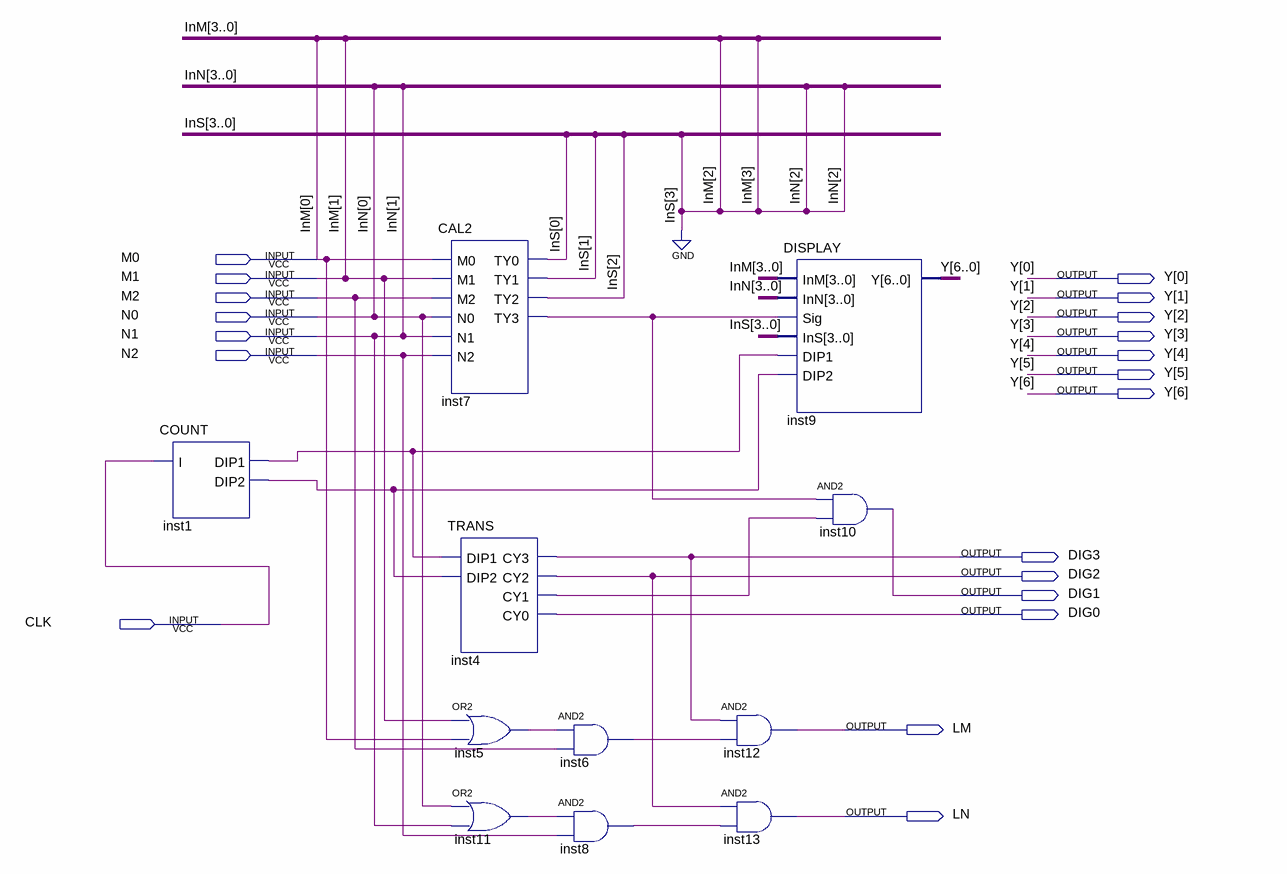
[diagram p0: schematic sheet]
// Quartus schematic FINAL.bdf as structural Verilog: 11 symbols, 20 pins
module FINAL (
  input  M0,
  input  M1,
  input  M2,
  input  N0,
  input  N1,
  input  N2,
  input  CLK,
  output [6:0] Y,
  output DIG3,
  output DIG2,
  output DIG1,
  output DIG0,
  output LM,
  output LN
);

  wire inst1_dip1, inst1_dip2, inst4_cy1, inst5_out, inst6_out, inst7_ty3, inst8_out, inst11_out;
  wire [2:0] InS;
  wire [3:3] InN;

  COUNT inst1 (.I(CLK), .DIP1(inst1_dip1), .DIP2(inst1_dip2));
  CAL2 inst7 (
    .M0(M0), .M1(M1), .M2(M2), .N0(N0), .N1(N1), .N2(N2), .TY0(InS[0]), .TY1(InS[1]), .TY2(InS[2]),
    .TY3(inst7_ty3));
  TRANS inst4 (.DIP1(inst1_dip1), .DIP2(inst1_dip2), .CY3(DIG3), .CY2(DIG2), .CY1(inst4_cy1), .CY0(DIG0));
  or inst5 (inst5_out, M1, M0);
  or inst11 (inst11_out, N0, N1);
  and inst6 (inst6_out, inst5_out, M2);
  and inst8 (inst8_out, inst11_out, N2);
  and inst12 (LM, DIG3, inst6_out);
  and inst13 (LN, DIG2, inst8_out);
  DISPLAY inst9 (
    .InM({2'b00, M1, M0}), .InN({InN[3], 1'b0, N1, N0}), .Sig(inst7_ty3), .InS({1'b0, InS}),
    .DIP1(inst1_dip1), .DIP2(inst1_dip2), .Y(Y));
  and inst10 (DIG1, inst7_ty3, inst4_cy1);

  // Other names for the same wires on the sheet: InM[1:0] = {M1, M0}; InN[1:0] = {N1, N0}
endmodule
